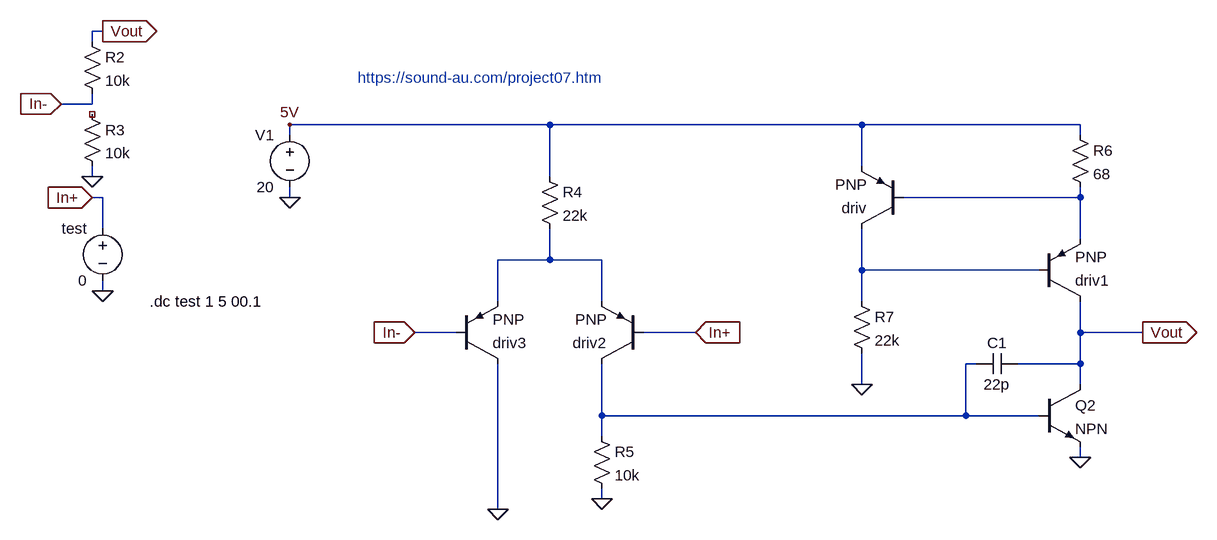
[diagram p0: schematic discrete_opamp_v1.asc]
discrete_opamp_v1.asc, the LTspice schematic file:
Version 4.1
SHEET 1 1244 680
WIRE -672 -384 -688 -384
WIRE -688 -368 -688 -384
WIRE -688 -272 -688 -288
WIRE -688 -272 -736 -272
WIRE 16 -240 -384 -240
WIRE 496 -240 16 -240
WIRE 832 -240 496 -240
WIRE -384 -224 -384 -240
WIRE 832 -224 832 -240
WIRE 496 -176 496 -240
WIRE -688 -160 -688 -176
WIRE 16 -160 16 -240
WIRE -672 -128 -688 -128
WIRE -384 -128 -384 -144
WIRE 832 -128 832 -144
WIRE 832 -128 560 -128
WIRE -672 -80 -672 -128
WIRE 832 -64 832 -128
WIRE 16 -32 16 -80
WIRE 16 -32 -64 -32
WIRE 96 -32 16 -32
WIRE 496 -16 496 -80
WIRE 768 -16 496 -16
WIRE -672 16 -672 0
WIRE -64 32 -64 -32
WIRE 96 32 96 -32
WIRE 496 32 496 -16
WIRE -128 80 -192 80
WIRE 240 80 160 80
WIRE 832 80 832 32
WIRE 928 80 832 80
WIRE 672 128 656 128
WIRE 832 128 832 80
WIRE 832 128 736 128
WIRE 496 160 496 112
WIRE 832 160 832 128
WIRE 96 208 96 128
WIRE 656 208 656 128
WIRE 656 208 96 208
WIRE 768 208 656 208
WIRE 96 240 96 208
WIRE 832 272 832 256
WIRE 96 336 96 320
WIRE -64 352 -64 128
FLAG -384 -128 0
FLAG -384 -240 5V
FLAG 928 80 Vout
IOPIN 928 80 Out
FLAG -192 80 In-
IOPIN -192 80 In
FLAG 240 80 In+
IOPIN 240 80 In
FLAG -736 -272 In-
IOPIN -736 -272 In
FLAG -688 -128 In+
IOPIN -688 -128 In
FLAG -672 -384 Vout
IOPIN -672 -384 Out
FLAG -672 16 0
FLAG -688 -160 0
FLAG 96 336 0
FLAG -64 352 0
FLAG 496 160 0
FLAG 832 272 0
SYMBOL voltage -384 -240 M0
SYMATTR InstName V1
SYMATTR Value 20
SYMBOL pnp 560 -80 R180
SYMATTR InstName driv
SYMBOL voltage -672 -96 M0
SYMATTR InstName test
SYMATTR Value 0
SYMBOL res -704 -384 R0
SYMATTR InstName R2
SYMATTR Value 10k
SYMBOL res -704 -272 R0
SYMATTR InstName R3
SYMATTR Value 10k
SYMBOL res 0 -176 R0
SYMATTR InstName R4
SYMATTR Value 22k
SYMBOL res 80 224 R0
SYMATTR InstName R5
SYMATTR Value 10k
SYMBOL res 816 -240 R0
SYMATTR InstName R6
SYMATTR Value 68
SYMBOL pnp 768 32 M180
SYMATTR InstName driv1
SYMBOL pnp 160 128 R180
SYMATTR InstName driv2
SYMBOL pnp -128 128 M180
SYMATTR InstName driv3
SYMBOL res 480 16 R0
SYMATTR InstName R7
SYMATTR Value 22k
SYMBOL npn 768 160 R0
SYMATTR InstName Q2
SYMBOL cap 736 112 R90
WINDOW 0 0 32 VBottom 2
WINDOW 3 32 32 VTop 2
SYMATTR InstName C1
SYMATTR Value 22p
TEXT -600 32 Left 2 !.dc test 1 5 00.1
TEXT -280 -312 Left 2 ;https://sound-au.com/project07.htm

The netlist it stands for:
* discrete_opamp_v1.asc
V1 5V 0 20
Q§driv N003 N001 5V 0 PNP
V§test In+ 0 0
R2 Vout In- 10k
R3 NC_01 0 10k
R4 5V N002 22k
R5 N004 0 10k
R6 5V N001 68
Q§driv1 Vout N003 N001 0 PNP
Q§driv2 N004 In+ N002 0 PNP
Q§driv3 0 In- N002 0 PNP
R7 N003 0 22k
Q2 Vout N004 0 0 NPN
C1 Vout N004 22p
.model NPN NPN
.model PNP PNP
.lib standard.bjt
.dc test 1 5 00.1
* https://sound-au.com/project07.htm
.backanno
.end